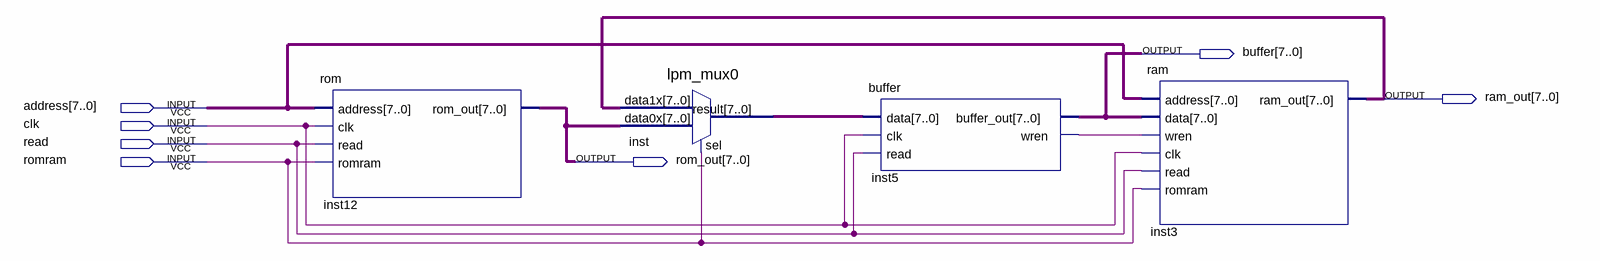
[diagram p0: schematic sheet]
// Quartus schematic main.bdf as structural Verilog: 4 symbols, 7 pins
module main (
  input  [7:0] address,
  input  clk,
  input  read,
  input  romram,
  output [7:0] buffer,
  output [7:0] ram_out,
  output [7:0] rom_out
);

  wire inst5_wren;
  wire [7:0] inst_result;

  rom inst12 (.address(address), .clk(clk), .read(read), .romram(romram), .rom_out(rom_out));
  lpm_mux0 inst (.data1x(ram_out), .data0x(rom_out), .sel(romram), .result(inst_result));
  buffer inst5 (.data(inst_result), .clk(clk), .read(read), .buffer_out(buffer), .wren(inst5_wren));
  ram inst3 (
    .address(address), .data(buffer), .wren(inst5_wren), .clk(clk), .read(read), .romram(romram),
    .ram_out(ram_out));
endmodule
